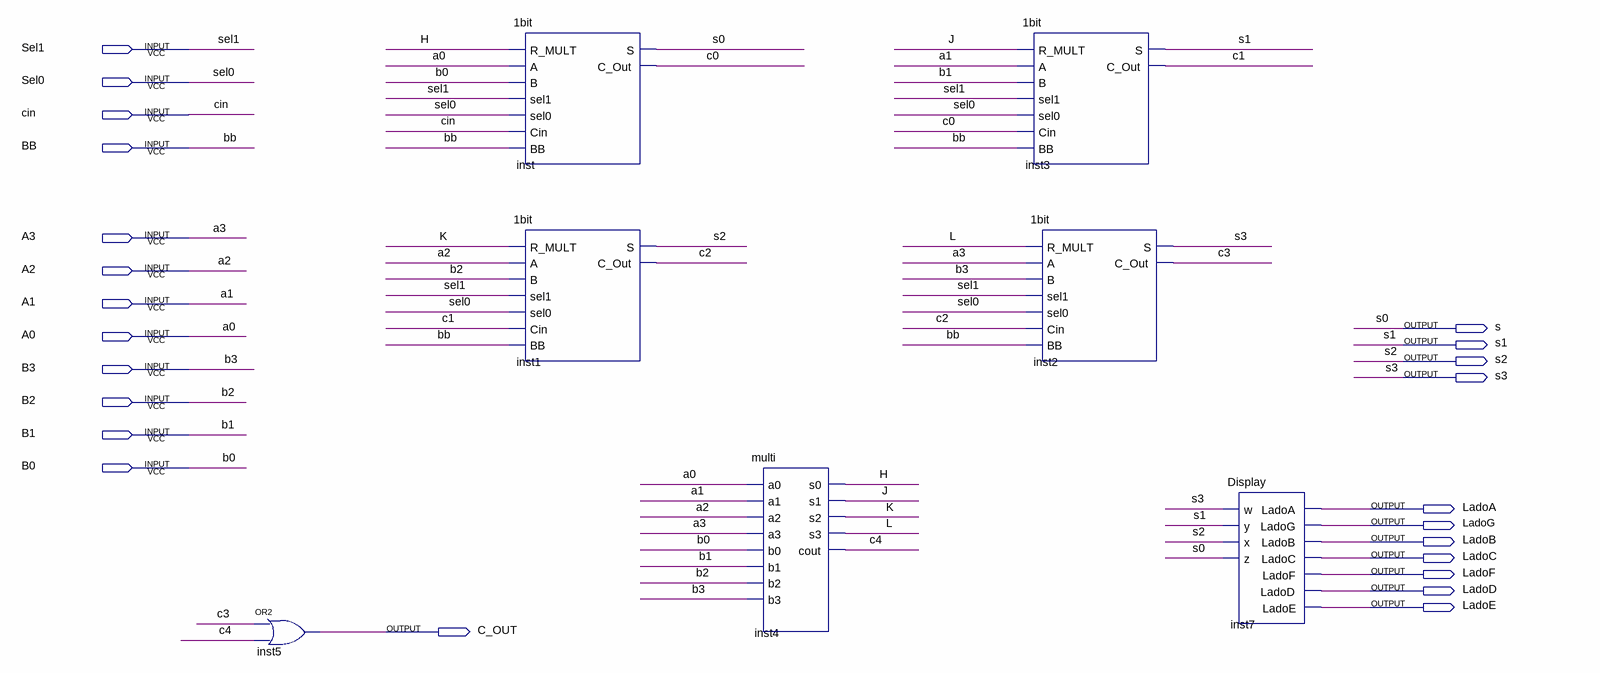
[diagram p0: schematic sheet]
// Quartus schematic Ula.bdf as structural Verilog: 7 symbols, 24 pins
module Ula (
  input  Sel1,
  input  Sel0,
  input  cin,
  input  BB,
  input  A3,
  input  A2,
  input  A1,
  input  A0,
  input  B3,
  input  B2,
  input  B1,
  input  B0,
  output s,
  output s1,
  output s2,
  output s3,
  output LadoA,
  output LadoG,
  output LadoB,
  output LadoC,
  output LadoF,
  output LadoD,
  output LadoE,
  output C_OUT
);

  wire c0, c1, c2, c3, c4, H, J, K, L;

  or inst5 (C_OUT, c3, c4);
  \1bit  inst (.R_MULT(H), .A(A0), .B(B0), .sel1(Sel1), .sel0(Sel0), .Cin(cin), .BB(BB), .S(s), .C_Out(c0));
  \1bit  inst1 (.R_MULT(K), .A(A2), .B(B2), .sel1(Sel1), .sel0(Sel0), .Cin(c1), .BB(BB), .S(s2), .C_Out(c2));
  multi inst4 (
    .a0(A0), .a1(A1), .a2(A2), .a3(A3), .b0(B0), .b1(B1), .b2(B2), .b3(B3), .s0(H), .s1(J), .s2(K), .s3(L),
    .cout(c4));
  \1bit  inst3 (.R_MULT(J), .A(A1), .B(B1), .sel1(Sel1), .sel0(Sel0), .Cin(c0), .BB(BB), .S(s1), .C_Out(c1));
  \1bit  inst2 (.R_MULT(L), .A(A3), .B(B3), .sel1(Sel1), .sel0(Sel0), .Cin(c2), .BB(BB), .S(s3), .C_Out(c3));
  Display inst7 (
    .w(s3), .y(s1), .x(s2), .z(s), .LadoA(LadoA), .LadoG(LadoG), .LadoB(LadoB), .LadoC(LadoC), .LadoF(LadoF),
    .LadoD(LadoD), .LadoE(LadoE));

  // Other names for the same wires on the sheet: s0 = s
endmodule
